# EAGLE design 8x8matrix_alt (EAGLE 6.5.0)
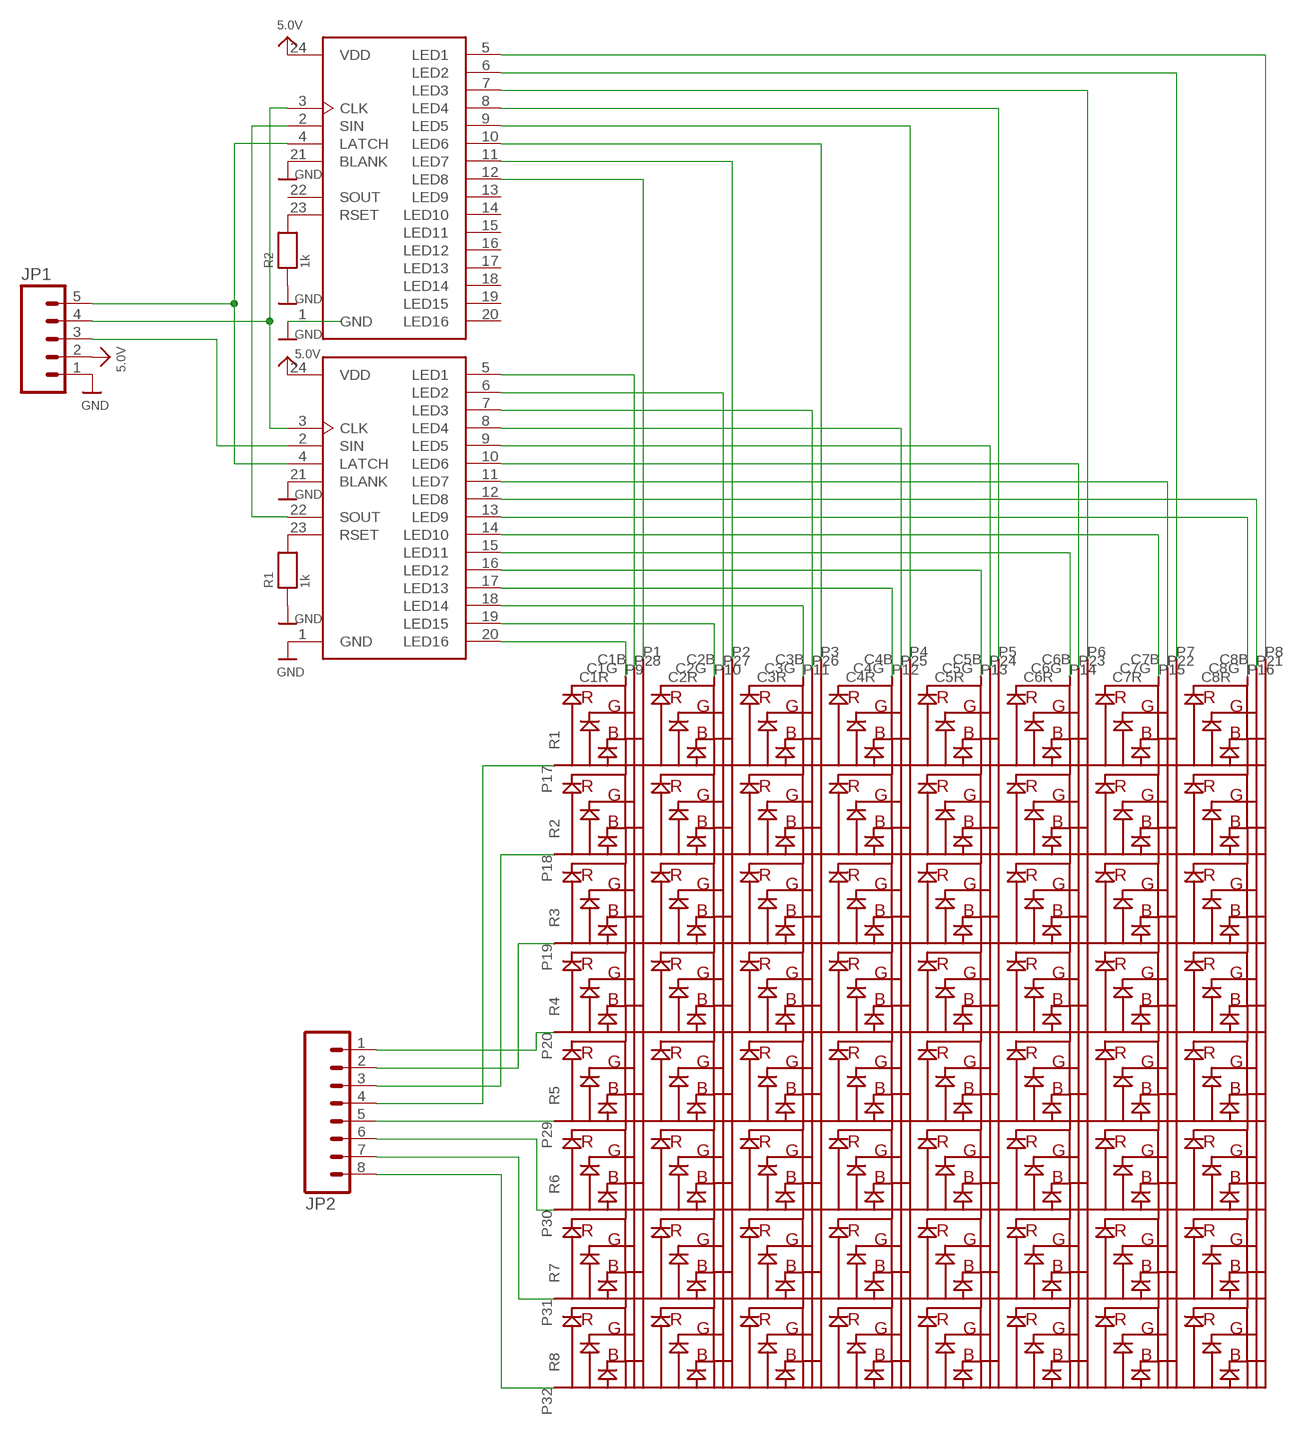
[diagram p0: schematic, sheet 1]

## Parts
JP1  M05PTH  [1X05]
JP2  M081X08  [1X08]
R1  1k  RESISTOR0805_NOTHERMALS  [0805_NOTHERMALS]
R2  1k  RESISTOR0805_NOTHERMALS  [0805_NOTHERMALS]
U$1  GTM2088ARGB  [8X8MATRIX]
U$2  CAT4016W  [TSSOP24]
U$3  CAT4016W  [TSSOP24]

## Nets
5.0V: JP1.2 U$2.24(VDD) U$3.24(VDD)
CLK: JP1.4 U$2.3(CLK) U$3.3(CLK)
GND: JP1.1 R1.1 R2.1 U$2.1(GND) U$2.21(BLANK) U$3.1(GND) U$3.21(BLANK)
LATCH: JP1.5 U$2.4(LATCH) U$3.4(LATCH)
N$1: U$1.P8(C8B) U$2.5(LED1)
N$2: U$1.P7(C7B) U$2.6(LED2)
N$3: U$1.P6(C6B) U$2.7(LED3)
N$4: U$1.P5(C5B) U$2.8(LED4)
N$5: U$1.P4(C4B) U$2.9(LED5)
N$6: U$1.P3(C3B) U$2.10(LED6)
N$7: U$1.P2(C2B) U$2.11(LED7)
N$8: U$1.P1(C1B) U$2.12(LED8)
N$9: U$1.P28(C1G) U$3.5(LED1)
N$10: U$1.P27(C2G) U$3.6(LED2)
N$11: U$1.P26(C3G) U$3.7(LED3)
N$12: U$1.P25(C4G) U$3.8(LED4)
N$13: U$1.P24(C5G) U$3.9(LED5)
N$14: U$1.P23(C6G) U$3.10(LED6)
N$15: U$1.P22(C7G) U$3.11(LED7)
N$16: U$1.P21(C8G) U$3.12(LED8)
N$17: U$1.P16(C8R) U$3.13(LED9)
N$18: U$1.P15(C7R) U$3.14(LED10)
N$19: U$1.P14(C6R) U$3.15(LED11)
N$20: U$1.P13(C5R) U$3.16(LED12)
N$21: U$1.P12(C4R) U$3.17(LED13)
N$22: U$1.P11(C3R) U$3.18(LED14)
N$23: U$1.P10(C2R) U$3.19(LED15)
N$24: U$1.P9(C1R) U$3.20(LED16)
N$25: JP2.5 U$1.P29(R5)
N$26: JP2.1 U$1.P20(R4)
N$28: R1.2 U$3.23(RSET)
N$29: R2.2 U$2.23(RSET)
N$30: JP2.2 U$1.P19(R3)
N$31: JP2.3 U$1.P18(R2)
N$32: JP2.4 U$1.P17(R1)
N$33: JP2.6 U$1.P30(R6)
N$34: JP2.7 U$1.P31(R7)
N$35: JP2.8 U$1.P32(R8)
SIN: JP1.3 U$3.2(SIN)
SOUT: U$2.2(SIN) U$3.22(SOUT)
Unconnected: U$2.13(LED9) U$2.14(LED10) U$2.15(LED11) U$2.16(LED12) U$2.17(LED13) U$2.18(LED14) U$2.19(LED15) U$2.20(LED16) U$2.22(SOUT)

## Library data of the parts
JP1 = SparkFun-Connectors:M05: Header 5 Standard 5-pin 0.1" header. Use with straight break away headers (SKU : PRT-00116), right angle break away headers (PRT-00553), swiss pins (PRT-00743), machine pins (PRT-00117), and female headers (PRT-00115). Molex polarized connector foot print use with SKU : PRT-08230 with associated crimp pins and housings.
JP2 = SparkFun-Connectors:M08: Header 8 Standard 8-pin 0.1" header. Use with straight break away headers (SKU : PRT-00116), right angle break away headers (PRT-00553), swiss pins (PRT-00743), machine pins (PRT-00117), and female headers (PRT-00115).
R1 R2 = microbuilder:RESISTOR: Resistors 0402 - 0402 Surface Mount Package 22 Ohm 1% 1/16W [Digikey: 311-22.0LRTR-ND] 33 Ohm 5% 1/16W 1.0K 5% 1/16W 1.5K 5% 1/16W 2.0K 1% 1/16W 10.0K 1% 1/16W [Digikey: 311-10.0KLRTR-ND] 10.0K 5% 1/16W [Digikey: RMCF0402JT10K0TR-ND] 12.1K 1% 1/16W [Digikey: 311-22.0LRTR-ND] 100.0K 5% 1/16W 0603 - 0603 Surface Mount Package 0 Ohm 1/10 Watt 1% Resistor 15 Ohm 1/10 Watt 1% Resistor 33 Ohm 1/10 Watt 1% Resistor 49.9 Ohm 1/10 Watt 1% Resistor 100 Ohm 1/10 Watt 1% Resistor 150 Ohm 1/10 Watt 1% Resistor 240 Ohm 1/10 Watt 1% Resistor 390 Ohm 1/10 Watt 1% Resistor 560 Ohm 1/10 Watt 1% Resistor 680 Ohm 1/10 Watt 1% Resistor 750 Ohm 1/10 Watt 1% Resistor 1.0K Ohm 1/10 Watt 1% Resistor 1.5K Ohm 1/10 Watt 1% Resistor 2.0K Ohm 1/10 Watt 1% Resistor 2.2K Ohm 1/10 Watt 1% Resistor 3.3K Ohm 1/10 Watt 1% Resistor 4.7K Ohm 1/10 Watt 1% Resistor 10.0K Ohm 1/10 Watt 1% Resistor 12.0K Ohm 1/10 Watt 1% Resistor 12.1K Ohm 1/10 Watt 1% Resistor 20.0K Ohm 1/10 Watt 1% Resistor 33.0K Ohm 1/10 Watt 1% Resistor 100.0K Ohm 1/10 Watt 1% Resistor 0805 - 0805 Surface Mount Package 0 Ohm 1/8 Watt 1% Resistor 33 Ohm 1/8 Watt 1% Resistor 100 Ohm 1/8 Watt 1% Resistor 150 Ohm 1/8 Watt 1% Resistor 200 Ohm 1/8 Watt 1% Resistor 240 Ohm 1/8 Watt 1% Resistor 330 Ohm 1/8 Watt 1% Resistor 390 Ohm 1/8 Watt 1% Resistor 470 Ohm 1/8 Watt 1% Resistor 1.0K Ohm 1/8 Watt 1% Resistor 1.5K Ohm 1/8 Watt 1% Resistor 2.0K Ohm 1/8 Watt 1% Resistor 4.7K Ohm 1/8 Watt 1% Resistor 5.1K Ohm 1/8 Watt 1% Resistor 5.6K Ohm 1/8 Watt 1% Resistor 10.0K Ohm 1/8 Watt 1% Resistor 22.0K Ohm 1/8 Watt 1% Resistor 33.0K Ohm 1/8 Watt 1% Resistor 100K Ohm 1/8 Watt 1% Resistor 1206 - 1206 Surface Mount Package 2012 - 2010 Surface Mount Package 0.11 Ohm 1/2 Watt 1% Resistor - Digikey: RHM.11UCT-ND
U$1 = mylib:GTM2088ARGB: a 8x8 RGB matrix
U$2 U$3 = CAT4016:CAT4016: 16-Channel Constant Current LED Driver

## Board
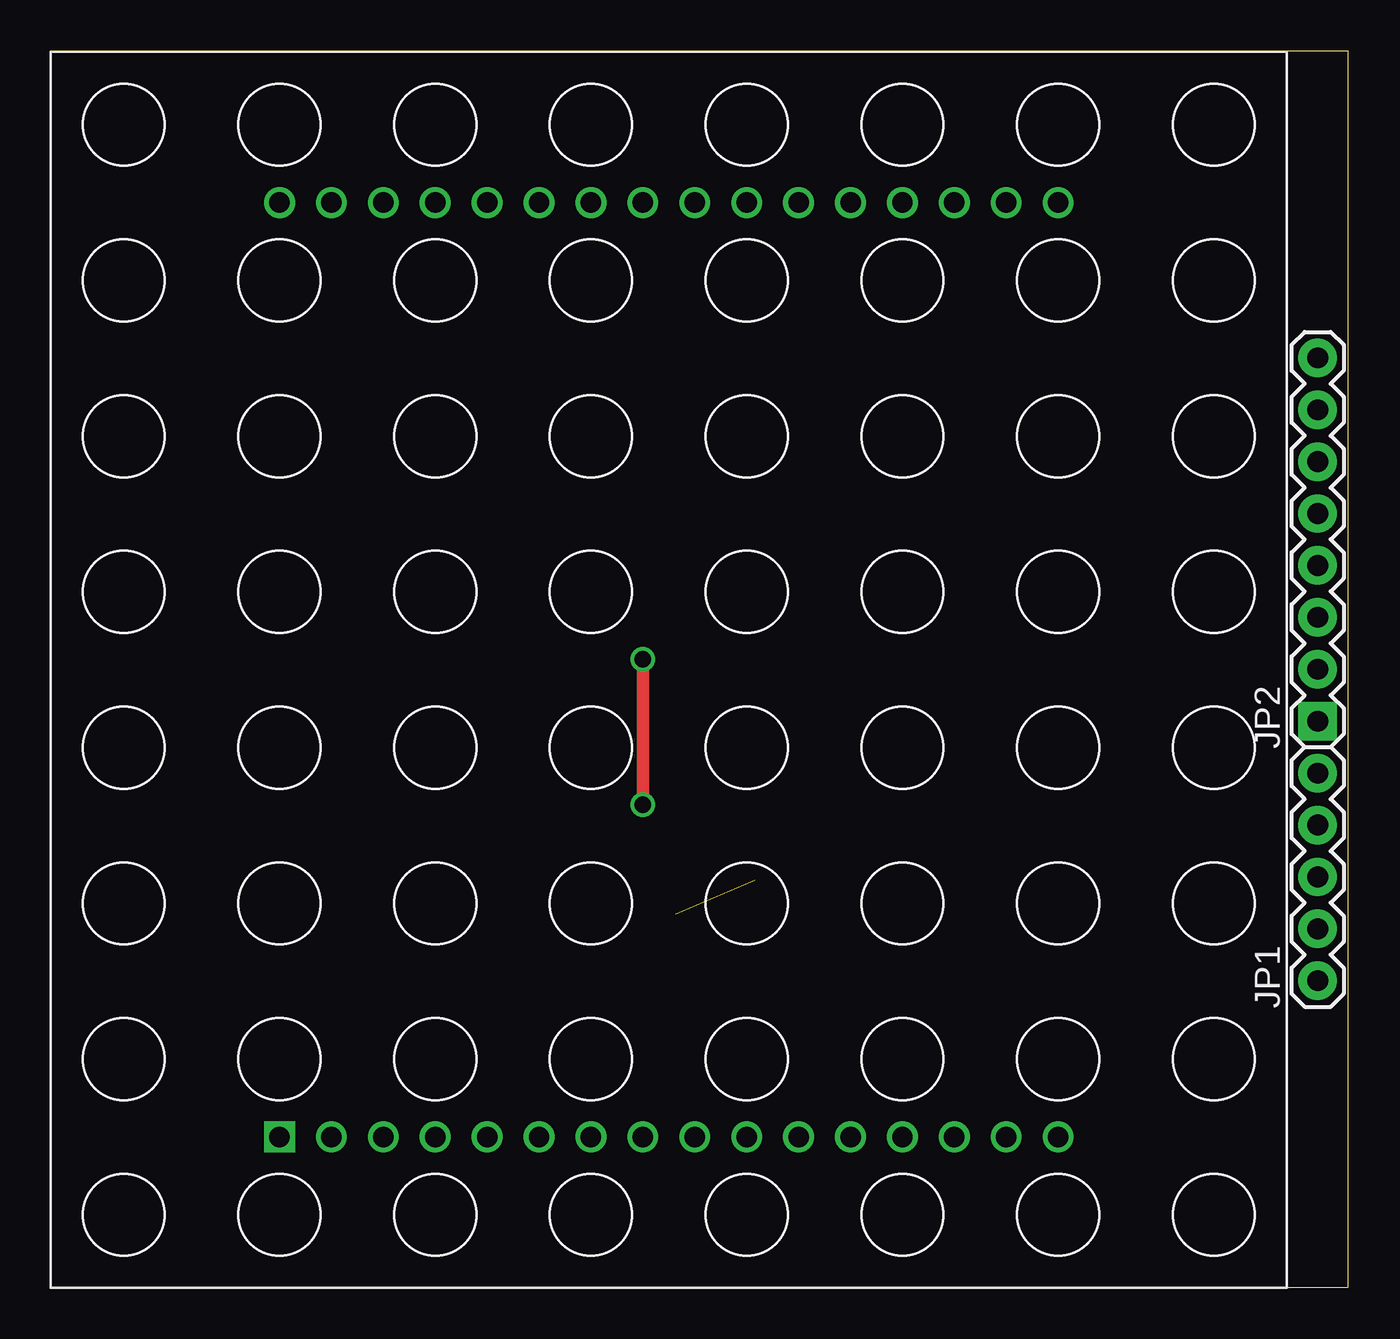
[diagram p1: board, top side]
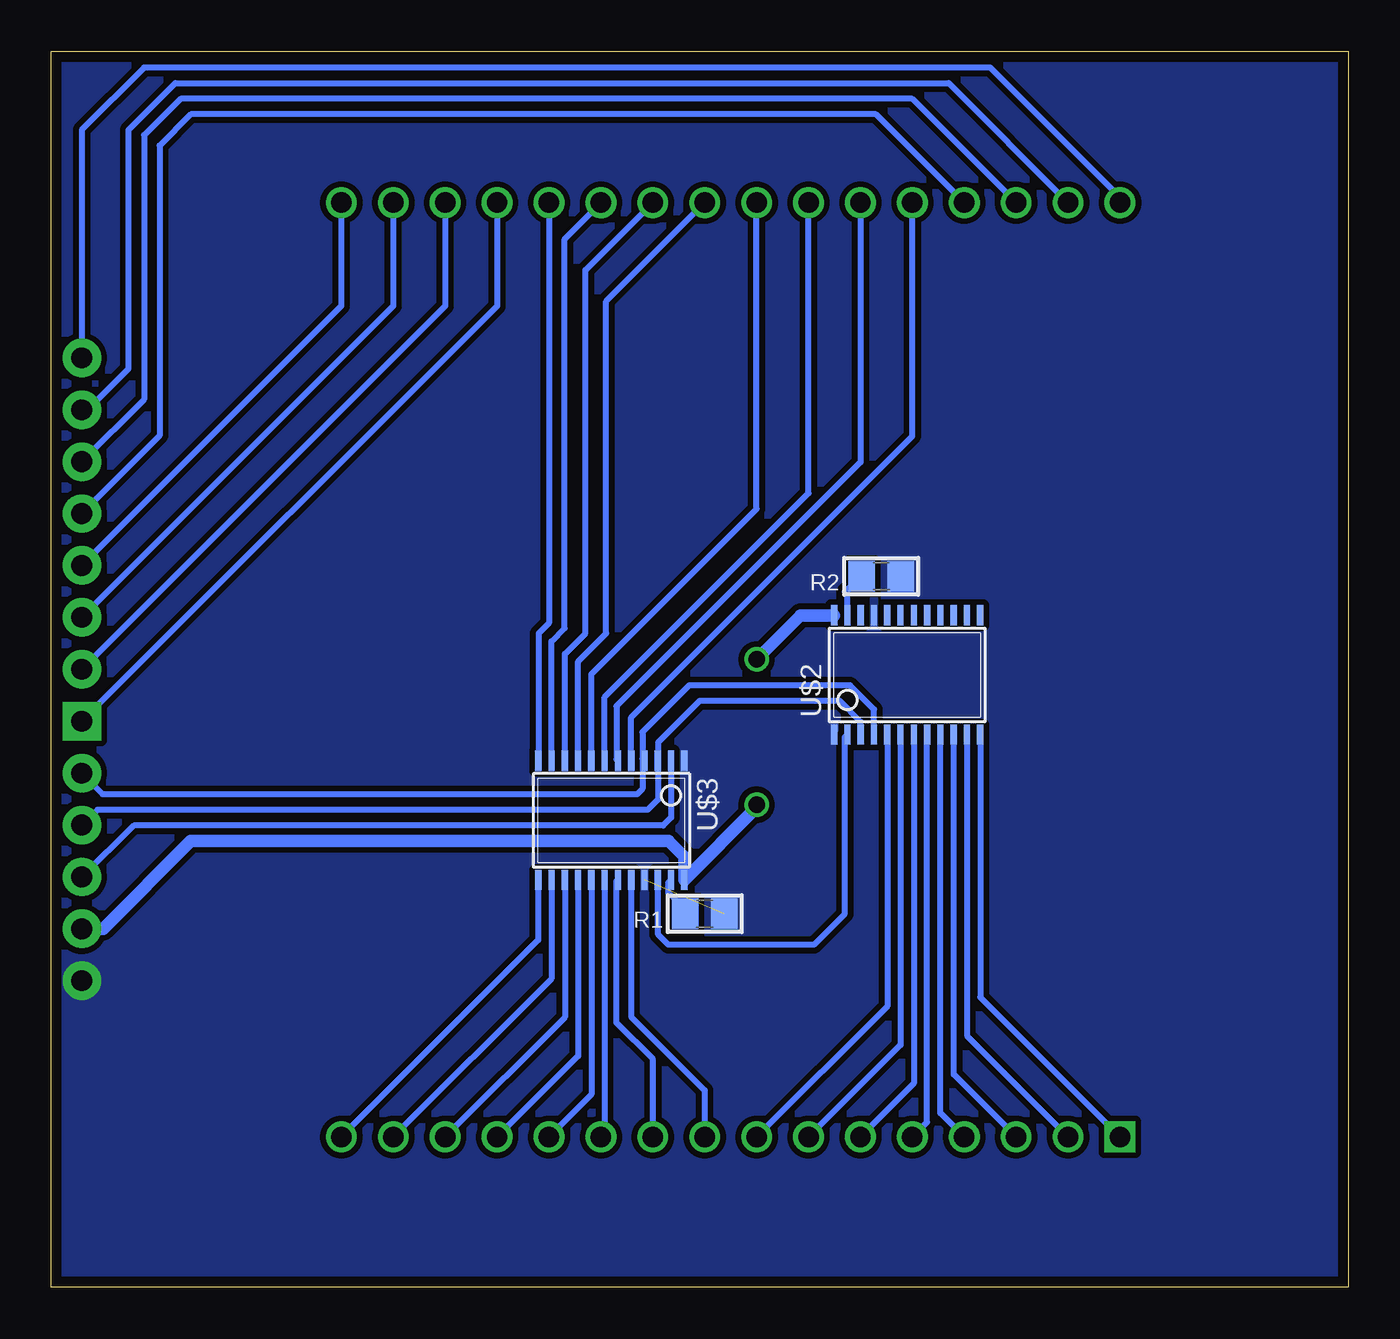
[diagram p2: board, bottom side, seen from below]

Size 63.48 x 60.5 mm. Coordinates in mm from the lower left corner, seen from the top.
Outline: 0,0 63.48,0 63.48,60.5 0,60.5 0,0
Copper layers (1*16): Top 0.035mm / dielectric 1.5mm / Bottom 0.035mm
Design rules "default *": minimum track width 10mil, minimum drill 24mil, track to track 8mil, track to pad 8mil, pad to pad 8mil, via to via 8mil, smd to smd 8mil, copper to edge 20mil, drill to drill 8mil, minimum pad ring 10mil, minimum via ring 8mil, stop-mask expansion 4mil, vias tented up to drill 0mil, thermal gap 10mil

### Footprints (pad centres in the part's own frame; a part is rotated, then mirrored left to right if it is on the bottom)
1X05 = drill 1.016 pad 1.88: 1 0,0; 2 2.54,0; 3 5.08,0; 4 7.62,0; 5 10.16,0
1X08 = drill 1.016 pad 1.88 square: 1 0,0 | drill 1.016 pad 1.88: 2 2.54,0; 3 5.08,0; 4 7.62,0; 5 10.16,0; 6 12.7,0; 7 15.24,0; 8 17.78,0
0805_NOTHERMALS = smd 1.3 x 1.5: 1 -0.95,0; 2 0.95,0
8X8MATRIX = drill 1 square: P1 -19.05,-22.86 | drill 1: P2 -16.51,-22.86; P3 -13.97,-22.86; P4 -11.43,-22.86; P5 -8.89,-22.86; P6 -6.35,-22.86; P7 -3.81,-22.86; P8 -1.27,-22.86; P9 1.27,-22.86; P10 3.81,-22.86; P11 6.35,-22.86; P12 8.89,-22.86; P13 11.43,-22.86; P14 13.97,-22.86; P15 16.51,-22.86; P16 19.05,-22.86; P17 19.05,22.86; P18 16.51,22.86; P19 13.97,22.86; P20 11.43,22.86; P21 8.89,22.86; P22 6.35,22.86; P23 3.81,22.86; P24 1.27,22.86; P25 -1.27,22.86; P26 -3.81,22.86; P27 -6.35,22.86; P28 -8.89,22.86; P29 -11.43,22.86; P30 -13.97,22.86; P31 -16.51,22.86; P32 -19.05,22.86
TSSOP24 = smd 0.305 x 0.991: 1 -3.575,-2.918; 2 -2.925,-2.918; 3 -2.275,-2.918; 4 -1.625,-2.918; 5 -0.975,-2.918; 6 -0.325,-2.918; 7 0.325,-2.918; 8 0.975,-2.918; 9 1.625,-2.918; 10 2.275,-2.918; 11 2.925,-2.918; 12 3.575,-2.918; 13 3.575,2.918; 14 2.925,2.918; 15 2.275,2.918; 16 1.625,2.918; 17 0.975,2.918; 18 0.325,2.918; 19 -0.325,2.918; 20 -0.975,2.918; 21 -1.625,2.918; 22 -2.275,2.918; 23 -2.925,2.918; 24 -3.575,2.918

### Placement (x,y rotation side)
JP1  61.98,15.01 90 top
JP2  61.98,27.71 90 top
R1  31.5,18.29 180 bottom
R2  22.86,34.8 180 bottom
U$1  30.23,30.23 0 top
U$2  21.59,29.97 0 bottom
U$3  36.07,22.86 180 bottom

### Tracks (layer width: path | path; a pad name or v marks a point on that pad's centre or on a via)
5.0V  (via drill 0.8)
  Top 0.61: v28.96,30.73 v28.96,23.62
  Bottom 0.305: v28.96,23.62 28.96,23.48 | U$3.24 32.49,20.09 29.72,22.86
  Bottom 0.61: U$2.24 26.8,32.89 v28.96,30.73 | 28.96,23.48 U$3.24 32.49,21.06 33.27,21.84 56.64,21.84 60.94,17.55 JP1.2
CLK
  Bottom 0.305: U$2.3 23.86,27.68 24.89,28.7 31.75,28.7 33.78,26.67 U$3.3 | U$3.3 | U$3.3 33.78,23.88 34.29,23.37 61.21,23.37 JP1.4
GND  (1 unrouted)
  pour Bottom (isolate 0.279, no thermals): 0,60.5 0,0 64.01,0.25 64.01,60.5
LATCH
  Bottom 0.305: U$2.4 23.21,28.3 24.38,29.46 32.26,29.46 34.54,27.18 34.54,25.88 | 34.54,25.88 U$3.4 | 34.54,25.88 34.54,24.38 34.8,24.13 60.96,24.13 JP1.5
N$1
  Bottom 0.305: U$2.5 22.57,13.76 U$1.P8
N$2
  Bottom 0.305: U$2.6 21.91,11.87 U$1.P7
N$3
  Bottom 0.305: U$2.7 21.27,9.98 U$1.P6
N$4
  Bottom 0.305: U$1.P5 20.61,8.09 U$2.8
N$5
  Bottom 0.305: U$1.P4 19.96,8.54 U$2.9
N$6
  Bottom 0.305: U$1.P3 19.32,10.43 U$2.10
N$7
  Bottom 0.305: U$2.11 18.66,12.31 U$1.P2
N$8
  Bottom 0.305: U$2.12 18.02,14.21 U$1.P1
N$9
  Bottom 0.305: U$3.5 35.09,27.9 21.34,41.66 U$1.P28
N$10
  Bottom 0.305: U$1.P27 23.88,40.39 35.81,28.45 35.81,25.85 U$3.6
N$11
  Bottom 0.305: U$3.7 36.39,28.89 26.42,38.86 U$1.P26
N$12
  Bottom 0.305: U$3.8 37.04,30.01 28.96,38.1 U$1.P25
N$13
  Bottom 0.305: U$3.9 37.69,30.63 36.32,32 36.32,48.26 U$1.P24
N$14
  Bottom 0.305: U$3.10 38.34,31 37.34,32 37.34,49.78 U$1.P23
N$15
  Bottom 0.305: U$3.11 38.99,31.62 38.35,32.26 38.35,51.31 U$1.P22
N$16
  Bottom 0.305: U$1.P21 39.12,32.51 39.62,32 39.62,25.8 U$3.12
N$17
  Bottom 0.305: U$3.13 39.64,17 U$1.P16
N$18
  Bottom 0.305: U$3.14 38.99,15.11 U$1.P15
N$19
  Bottom 0.305: U$3.15 38.34,13.22 U$1.P14
N$20
  Bottom 0.305: U$3.16 37.69,11.33 U$1.P13
N$21
  Bottom 0.305: U$3.17 37.04,9.44 U$1.P12
N$22
  Bottom 0.305: U$3.18 36.39,7.55 U$1.P11
N$23
  Bottom 0.305: U$1.P10 34.04,11.18 35.81,12.95 35.81,19.87 U$3.19
N$24
  Bottom 0.305: U$3.20 35.09,13.25 31.5,9.65 U$1.P9
N$25
  Bottom 0.305: U$1.P29 23.11,57.4 56.64,57.4 58.17,55.88 58.17,41.68 JP2.5
N$26
  Bottom 0.305: U$1.P20 41.66,48.03 JP2.1
N$28
  Bottom 0.305: R1.2 32.26,18.29 33.27,19.3 33.27,19.82 U$3.23
N$29
  Bottom 0.305: R2.2 23.88,34.8 24.52,34.16 | 24.52,34.16 24.64,34.04 | U$2.23 24.52,34.16
N$30
  Bottom 0.305: U$1.P19 44.2,48.03 JP2.2
N$31
  Bottom 0.305: U$1.P18 46.74,48.03 JP2.3
N$32
  Bottom 0.305: U$1.P17 49.28,48.03 JP2.4
N$33
  Bottom 0.305: U$1.P30 21.34,58.17 57.15,58.17 58.93,56.39 58.93,43.46 JP2.6
N$34
  Bottom 0.305: JP2.7 61.7,42.95 59.69,44.96 59.69,56.64 57.4,58.93 19.56,58.93 U$1.P31
N$35
  Bottom 0.305: U$1.P32 11.18,53.34 17.53,59.69 58.93,59.69 61.98,56.64 JP2.8
SIN
  Bottom 0.305: U$3.2 33.14,22.99 33.53,22.61 59.44,22.61 JP1.3
SOUT
  Bottom 0.305: U$3.22 33.78,17.27 33.27,16.76 26.16,16.76 24.64,18.29 24.64,26.93 U$2.2